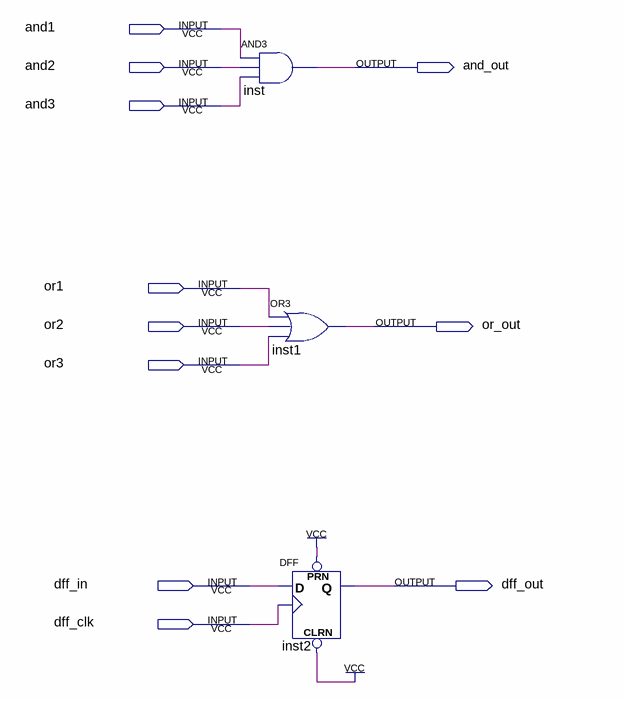
[diagram p0: schematic sheet]
// Quartus schematic pld_ex1.bdf as structural Verilog: 3 symbols, 11 pins
module pld_ex1 (
  input  and1,
  input  and2,
  input  and3,
  input  or1,
  input  or2,
  input  or3,
  input  dff_in,
  input  dff_clk,
  output and_out,
  output or_out,
  output dff_out
);

  and inst (and_out, and1, and2, and3);
  or inst1 (or_out, or1, or2, or3);
  DFF inst2 (.CLRN(1'b1), .CLK(dff_clk), .D(dff_in), .PRN(1'b1), .Q(dff_out));
endmodule
